# EAGLE schematic encoder (EAGLE 9.6.2)
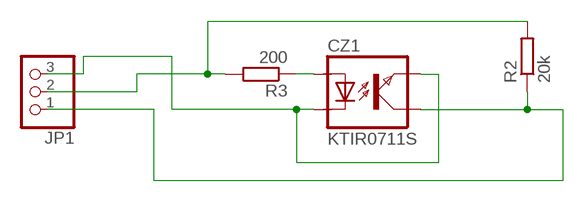
[diagram p0: schematic, sheet 1]

## Parts
CZ1  KTIR0711S  [TOP]
JP1  PINHD-1X3  [1X03]
R2  20k  R-EU_R0805  [R0805]
R3  200  R-EU_R0805  [R0805]

## Nets
N$1: CZ1.EMITER CZ1.KATODA JP1.3
N$2: CZ1.KOLEKTOR JP1.1 R2.1
N$4: CZ1.ANODA R3.1
N$5: JP1.2 R2.2 R3.2

## Library data of the parts
CZ1 = KTIR0711S:KTIR0711S
JP1 = pinhead:PINHD-1X3: PIN HEADER
R2 R3 = rcl:R-EU_: RESISTOR, European symbol; SPICEPREFIX: R